# Altium schematic sheet Ethernet_Interface.SchDoc: STM32F446 CNC
size B; Author: AM; CompanyName: Expatria Technologies; DrawnBy: A.Marles; Engineer: AM; Organization: Expatria Technolgoies; Address1: PO Box 2084; Address3: Merritt, BC V1K 1B8; Address4: Canada; DocumentNumber: 7; SheetNumber: 7; SheetTotal: 26
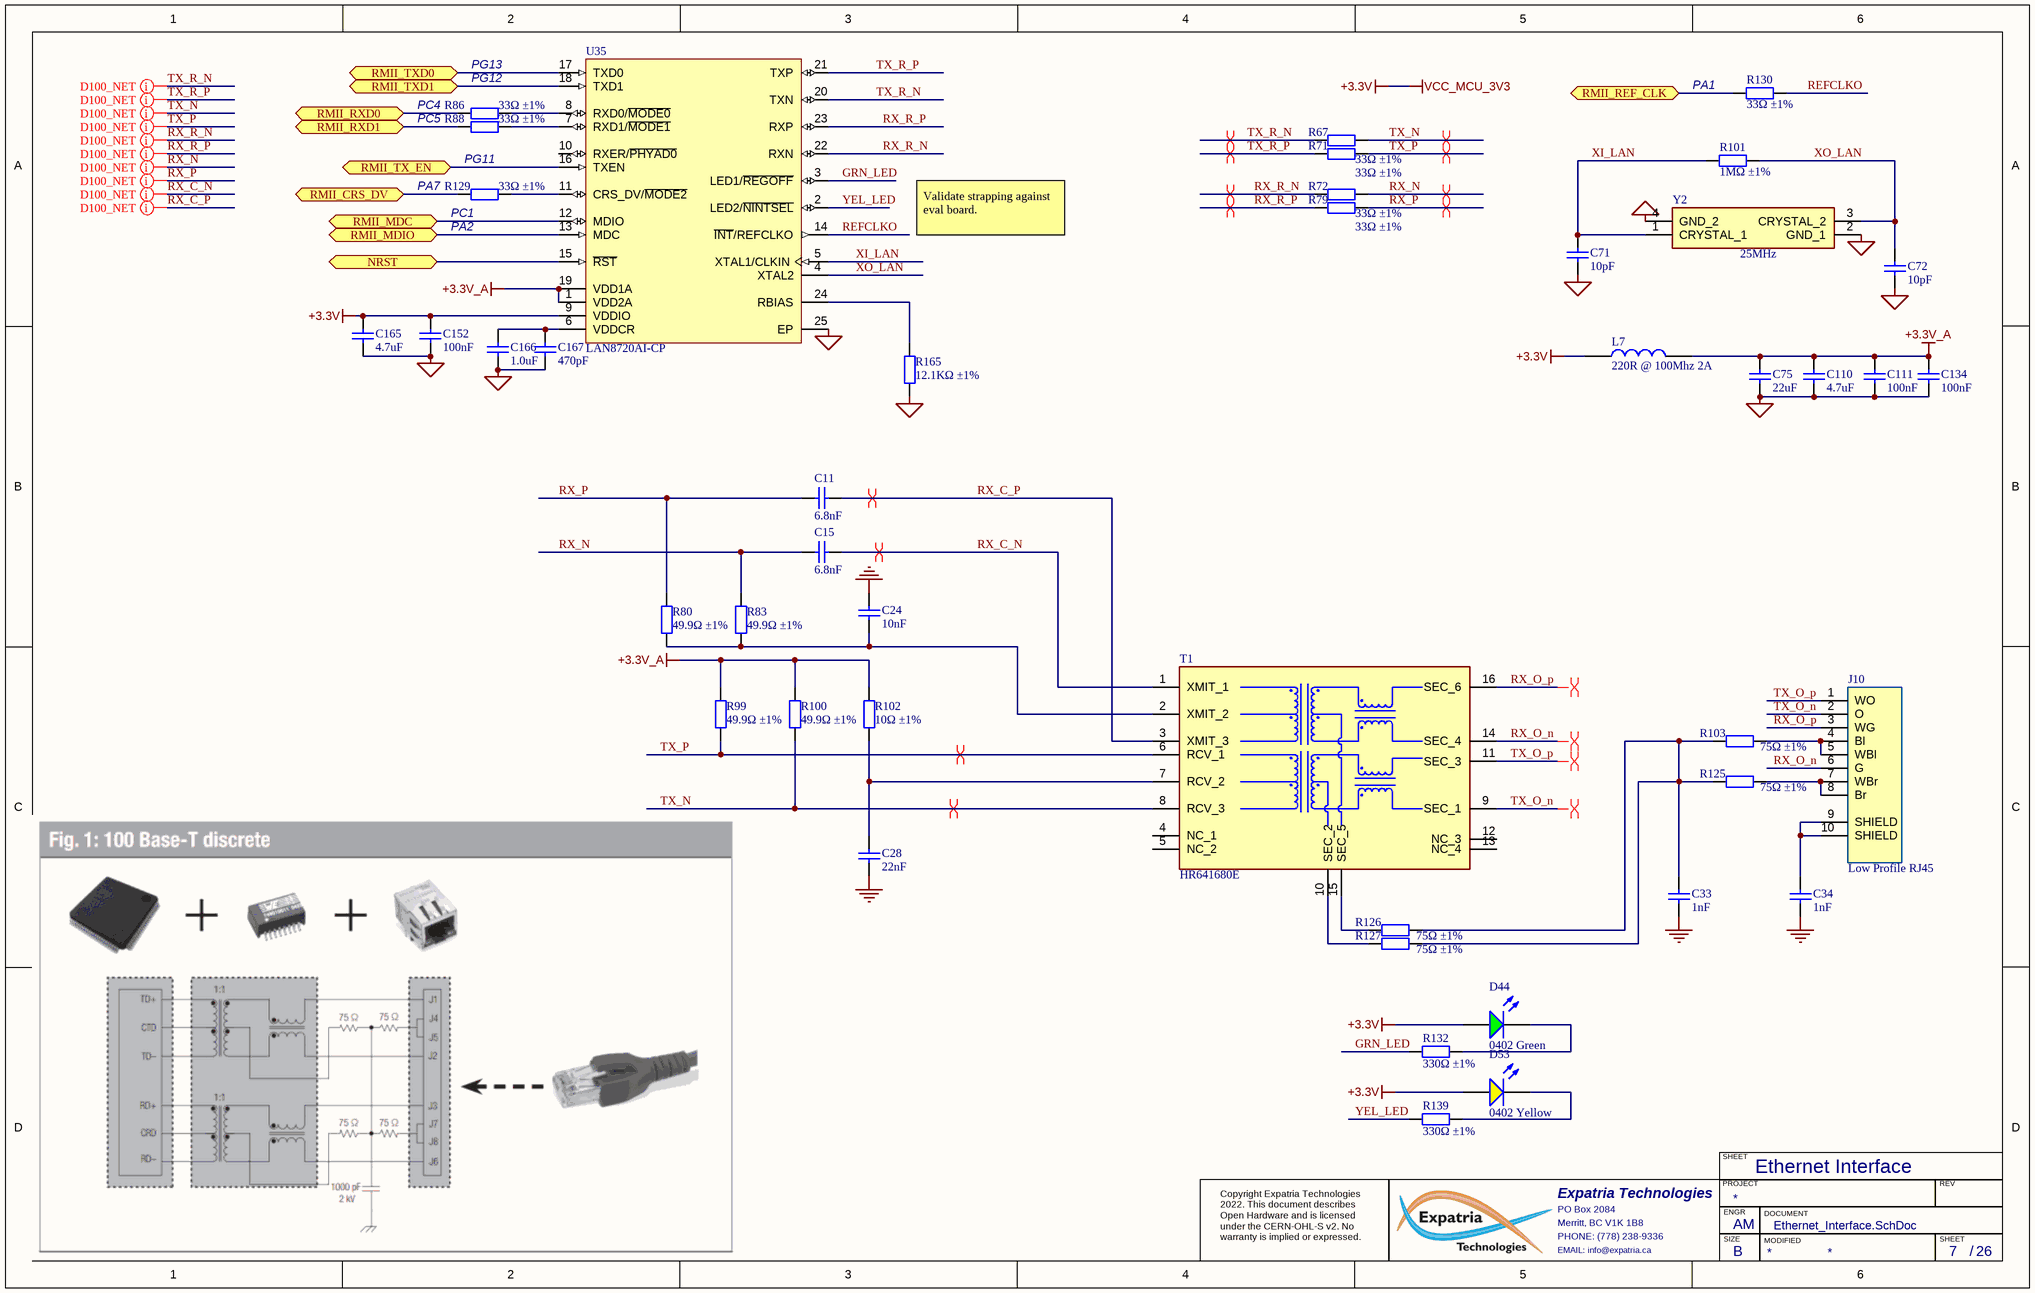
[diagram p0: Ethernet_Interface.SchDoc]

## Parts
C11  6.8nF  [0402_C]
C15  6.8nF  [0402_C]
C24  10nF  [0402_C]
C28  22nF  [0402_C]
C33  1nF  [1206_C]
C34  1nF  [1206_C]
C71  10pF  [0402_C]
C72  10pF  [0402_C]
C75  22uF  [0805_C]
C110  4.7uF  [0603_C]
C111  100nF  [0402_C]
C134  100nF  [0402_C]
C152  100nF  [0402_C]
C165  4.7uF  [0603_C]
C166  1.0uF  [0402_C]
C167  470pF  [0402_C]
D44  0402 Green  [LED 0402_1005 RED]
D53  0402 Yellow  [LED 0402_1005 RED]
J10  Low Profile RJ45  [RJ45-SMD_MJ88-B011-HLSV6-P]
L7  220R @ 100Mhz 2A  [0805_R]
R67  33Ω ±1%  [0402_R]
R71  33Ω ±1%  [0402_R]
R72  33Ω ±1%  [0402_R]
R79  33Ω ±1%  [0402_R]
R80  49.9Ω ±1%  [0402_R]
R83  49.9Ω ±1%  [0402_R]
R86  33Ω ±1%  [0402_R]
R88  33Ω ±1%  [0402_R]
R99  49.9Ω ±1%  [0402_R]
R100  49.9Ω ±1%  [0402_R]
R101  1MΩ ±1%  [0402_R]
R102  10Ω ±1%  [0402_R]
R103  75Ω ±1%  [0402_R]
R125  75Ω ±1%  [0402_R]
R126  75Ω ±1%  [0402_R]
R127  75Ω ±1%  [0402_R]
R129  33Ω ±1%  [0402_R]
R130  33Ω ±1%  [0402_R]
R132  330Ω ±1%  [0402_R]
R139  330Ω ±1%  [0402_R]
R165  12.1KΩ ±1%  [0805_R]
T1  HR641680E  [HR641680E]
U35  LAN8720AI-CP  [MCHP-QFN-24_V]
Y2  value 25MHz  [YSX321SL]  (hidden comment: X322525MSB4SI)

## Ports
NRST (bidir), RMII_CRS_DV (bidir), RMII_MDC (bidir), RMII_MDIO (bidir), RMII_REF_CLK (bidir), RMII_RXD0 (bidir), RMII_RXD1 (bidir), RMII_TX_EN (bidir), RMII_TXD0 (bidir), RMII_TXD1 (bidir)

## Nets
+3.3V: C152.2 C165.2 D44.A D53.A L7.1 U35.9(VDDIO)  [also labelled VCC_MCU_3V3]
+3.3V_A: C75.2 C110.2 C111.2 C134.2 L7.2 R99.1 R100.1 R102.1 U35.1(VDD2A) U35.19(VDD1A)
GND: C24.1 C28.1 C33.1 C34.1
MCU_GND: C71.1 C72.1 C75.1 C110.1 C111.1 C134.1 C152.1 C165.1 C166.1 C167.1 R165.1 U35.25(EP) Y2.2(GND_1) Y2.4(GND_2)
GRN_LED: R132.1 U35.3(LED1/~{REGOFF})
NRST: U35.15(~{RST}) ; port NRST
REFCLKO: R130.2 U35.14(~{INT}/REFCLKO)
RMII_CRS_DV: R129.1 ; port RMII_CRS_DV
RMII_MDC: U35.12(MDIO) ; port RMII_MDC
RMII_MDIO: U35.13(MDC) ; port RMII_MDIO
RMII_REF_CLK: R130.1 ; port RMII_REF_CLK
RMII_RXD0: R86.1 ; port RMII_RXD0
RMII_RXD1: R88.1 ; port RMII_RXD1
RMII_TX_EN: U35.16(TXEN) ; port RMII_TX_EN
RMII_TXD0: U35.17(TXD0) ; port RMII_TXD0
RMII_TXD1: U35.18(TXD1) ; port RMII_TXD1
RX_C_N: C15.1 T1.1(XMIT_1)
RX_C_P: C11.1 T1.3(XMIT_3)
RX_N: C15.2 R72.1 R83.2
RX_O_n: J10.6(G) T1.14(SEC_4)
RX_O_p: J10.3(WG) T1.16(SEC_6)
RX_P: C11.2 R79.1 R80.2
RX_R_N: R72.2 U35.22(RXN)
RX_R_P: R79.2 U35.23(RXP)
TX_N: R67.1 R100.2 T1.8(RCV_3)
TX_O_n: J10.2(O) T1.9(SEC_1)
TX_O_p: J10.1(WO) T1.11(SEC_3)
TX_P: R71.1 R99.2 T1.6(RCV_1)
TX_R_N: R67.2 U35.20(TXN)
TX_R_P: R71.2 U35.21(TXP)
XI_LAN: C71.2 R101.1 U35.5(XTAL1/CLKIN) Y2.1(CRYSTAL_1)
XO_LAN: C72.2 R101.2 U35.4(XTAL2) Y2.3(CRYSTAL_2)
YEL_LED: R139.1 U35.2(LED2/~{NINTSEL})
NetC24_2: C24.2 R80.1 R83.1 T1.2(XMIT_2)
NetC28_2: C28.2 R102.2 T1.7(RCV_2)
NetC33_2: C33.2 R103.2 R125.2 R126.1 R127.1
NetC34_2: C34.2 J10.9(SHIELD) J10.10(SHIELD)
NetC166_2: C166.2 C167.2 U35.6(VDDCR)
NetD44_K: D44.K R132.2
NetD53_K: D53.K R139.2
NetJ10_4: J10.4(Bl) J10.5(WBl) R103.1
NetJ10_7: J10.7(WBr) J10.8(Br) R125.1
NetR86_2: R86.2 U35.8(RXD0/~{MODE0})
NetR88_2: R88.2 U35.7(RXD1/~{MODE1})
NetR126_2: R126.2 T1.15(SEC_5)
NetR127_2: R127.2 T1.10(SEC_2)
NetR129_2: R129.2 U35.11(CRS_DV/~{MODE2})
NetR165_2: R165.2 U35.24(RBIAS)

Not connected (* = marked no-connect by the designer): T1 4(NC_1) 5(NC_2) 12(NC_3) 13(NC_4); U35 10(RXER/~{PHYAD0})

## Layout directives
differential pair: RX_C_N, RX_C_P, RX_N, RX_O_n, RX_O_p, RX_P, RX_R_N, RX_R_P, TX_N, TX_O_n, TX_O_p, TX_P, TX_R_N, TX_R_P
net class D100_NET: RX_C_N, RX_C_P, RX_N, RX_P, RX_R_N, RX_R_P, TX_N, TX_P, TX_R_N, TX_R_P

## Notes on the sheet
- PG13
- PG12
- (near R130) PA1
- PC4
- PC5
- PG11
- (near R129) PA7
- (near R129) PC1
- (near R129) PA2
- Validate strapping against eval board.
- Ethernet Interface
- SHEET
- Expatria Technologies
- PO Box 2084
- Merritt, BC V1K 1B8
- PHONE: (778) 238-9336
- PROJECT
- SIZE
- ENGR
- MODIFIED
- DOCUMENT
- REV
- Copyright Expatria Technologies 2022. This document describes Open Hardware and is licensed under the CERN-OHL-S v2. No warranty is implied or expressed.
- EMAIL: info@expatria.ca
- B
- /

## Library data of the parts
C11 C15 = 0402 6.8nF (682) 10% 50V: Chip capacitors; Manufacturer: Guangdong Fenghua Advanced Tech; PartNumber: 0402B682K500NT; Tolerance: 10%; Voltage: 50V; ComponentLink1Description: Supplier link; ComponentLink1URL: http://www.szlcsc.com/product/details_1894.html; Package: 0402; Supplier: LC; SuppliersPartNumber: C1542; Capacitance: 6.8nF
C24 = 0402 10nF (103) 10% 50V: Chip capacitors; Manufacturer: Samsung Electro-Mechanics; PartNumber: CL05B103KB5NNNC; Tolerance: 10%; Voltage: 50V; ComponentLink1Description: Supplier link; ComponentLink1URL: http://www.szlcsc.com/product/details_15869.html; Package: 0402; Supplier: LC; SuppliersPartNumber: C15195; Capacitance: 10nF
C28 = 0402 22nF (223) 10% 50V: Chip capacitors; Manufacturer: Guangdong Fenghua Advanced Tech; PartNumber: 0402B223K500NT; Tolerance: 10%; Voltage: 50V; ComponentLink1Description: Supplier link; ComponentLink1URL: http://www.szlcsc.com/product/details_1884.html; Package: 0402; Supplier: LC; SuppliersPartNumber: C1532; Capacitance: 22nF
C33 C34 = 1206 1nF (102) 10% 500V: Chip capacitors; Manufacturer: Samsung Electro-Mechanics; PartNumber: CL31B102KGFNNNE; Tolerance: 10%; Voltage: 500V; ComponentLink1Description: Supplier link; ComponentLink1URL: http://www.szlcsc.com/product/details_36187.html; Package: 1206; Supplier: LC; SuppliersPartNumber: C35216; Capacitance: 1nF
C71 C72 = 0402 10pF (100) 5% 50V: Chip capacitors; Manufacturer: Samsung Electro-Mechanics; Manufacturer Part Number: CL05C100JB5NNNC; Tolerance: 5%; Voltage: 50V; ComponentLink1Description: Supplier link; ComponentLink1URL: http://www.szlcsc.com/product/details_33914.html; Package: 0402; Supplier: LC; SuppliersPartNumber: C32949; Capacitance: 10pF
C75 = 0805 22uF (226) 20% 25V: 25V 22uF X5R ±20% 0805 Multilayer Ceramic Capacitors MLCC - SMD/SMT ROHS; Manufacturer: Samsung Electro-Mechanics; Manufacturer Part Number: CL21A226MAQNNNE; ComponentLink1Description: Supplier link; ComponentLink1URL: http://www.szlcsc.com/product/details_46786.html; Package: 0805; Supplier: LC; SuppliersPartNumber: C45783; Capacitance: 22uF; Tolerance: 20%; Voltage: 25V
C110 C165 = 0603 4.7uF (475) 10% 16V: 16V 4.7uF X5R ±10% 0603 Multilayer Ceramic Capacitors MLCC - SMD/SMT ROHS; Manufacturer: Samsung Electro-Mechanics; Manufacturer Part Number: CL10A475KO8NNNC; ComponentLink1Description: Supplier link; ComponentLink1URL: http://www.szlcsc.com/product/details_20375.html; Package: 0603; Supplier: LC; SuppliersPartNumber: C19666; Capacitance: 4.7uF; Tolerance: 10%; Voltage: 16V
C111 C134 C152 = 0402 100nF (104) 10% 16V: 16V 100nF X7R ±10% 0402 Multilayer Ceramic Capacitors MLCC - SMD/SMT ROHS; Manufacturer: Samsung Electro-Mechanics; Manufacturer Part Number: CL05B104KO5NNNC; ComponentLink1Description: Supplier link; ComponentLink1URL: http://www.szlcsc.com/product/details_1877.html; Package: 0402; Supplier: LC; SuppliersPartNumber: C1525; Capacitance: 100nF; Tolerance: 10%; Voltage: 16V
C166 = 0402 1.0uF (105) 10% 25V: Chip capacitor; Manufacturer: Samsung Electro-Mechanics; PartNumber: CL05A105KA5NQNC; Capacitance: 1uF; Tolerance: 10%; Voltage: 25V; ComponentLink1Description: Supplier link; ComponentLink1URL: http://www.szlcsc.com/product/details_53938.html; Package: 0402; Supplier: LC; SuppliersPartNumber: C52923
C167 = 0402 470pF (471) 10% 50V: Chip capacitors; Manufacturer: Guangdong Fenghua Advanced Tech; PartNumber: 0402B471K500NT; Tolerance: 10%; Voltage: 50V; ComponentLink1Description: Supplier link; ComponentLink1URL: http://www.szlcsc.com/product/details_1889.html; Package: 0402; Supplier: LC; SuppliersPartNumber: C1537; Capacitance: 470pF
D44 = 0402 LED Green: LED; Package: 0402; Supplier: LC; SuppliersPartNumber: C130723; Color: Green
D53 = 0402 LED Yellow: LED; ComponentLink1Description: 供应商链接; ComponentLink1URL: http://www.szlcsc.com/product/details_73147.html; Package: 0402; Supplier: LC; SuppliersPartNumber: C130721; Color: Yellow
J10 = MJ88-B011-HLSV6-P: Micro USB; MF: Heling; SuppliersPartNumber: C501463; Part+Number: MJ88-B011-HLSV6-P
L7 = CBW201209U221T: 150mΩ ±25% 220Ω@100MHz 0805 Ferrite Beads ROHS; Manufacturer: FH (Guangdong Fenghua Advanced Tech); Package: 0402; Supplier: LC; SuppliersPartNumber: C139188; Manufacturer Part Number: CBW201209U221T
R67 R71 R72 R79 R86 R88 R129 R130 = 0402 33R (33R0) 1%: Chip resistor; Manufacturer: Uniroyal Elec; Manufacturer Part Number: 0402WGF330JTCE; Power: 1/16W; ComponentLink1Description: Supplier link; ComponentLink1URL: http://www.szlcsc.com/product/details_25848.html; Package: 0402; Supplier: LC; SuppliersPartNumber: C25105; Resistance: 33Ω; Tolerance: 1%
R80 R83 R99 R100 = 0402 49.9R (49R9) 1%: Chip resistor; Manufacturer: Uniroyal Elec; PartNumber: 0402WGF499JTCE; Power: 1/16W; ComponentLink1Description: Supplier link; ComponentLink1URL: http://www.szlcsc.com/product/details_25863.html; Package: 0402; Supplier: LC; SuppliersPartNumber: C25120; Resistance: 49.9Ω; Tolerance: 1%
R101 = 0402 1M (1004) 1%: Chip resistor; Manufacturer: Uniroyal Elec; Manufacturer Part Number: 0402WGF1004TCE; Power: 1/16W; ComponentLink1Description: Supplier link; ComponentLink1URL: http://www.szlcsc.com/product/details_26826.html; Package: 0402; Supplier: LC; SuppliersPartNumber: C26083; Resistance: 1MΩ; Tolerance: 1%
R102 = 0402 10R (10R0) 1%: Chip resistor; Manufacturer: Uniroyal Elec; PartNumber: 0402WGF100JTCE; Power: 1/16W; ComponentLink1Description: Supplier link; ComponentLink1URL: http://www.szlcsc.com/product/details_25820.html; Package: 0402; Supplier: LC; SuppliersPartNumber: C25077; Resistance: 10Ω; Tolerance: 1%
R103 R125-R127 = 0402 75R (75R0) 1%: Chip resistor; Manufacturer: Uniroyal Elec; PartNumber: 0402WGF750JTCE; Power: 1/16W; ComponentLink1Description: Supplier link; ComponentLink1URL: http://www.szlcsc.com/product/details_25876.html; Package: 0402; Supplier: LC; SuppliersPartNumber: C25133; Resistance: 75Ω; Tolerance: 1%
R132 R139 = 0402 330R (3300) 1%: Chip resistor; Manufacturer: Uniroyal Elec; PartNumber: 0402WGF3300TCE; Power: 1/16W; ComponentLink1Description: Supplier link; ComponentLink1URL: http://www.szlcsc.com/product/details_25847.html; Package: 0402; Supplier: LC; SuppliersPartNumber: C25104; Resistance: 330Ω; Tolerance: 1%
R165 = 0805 12.1K (1212) 1%: Chip resistor; Manufacturer: Uniroyal Elec; Power: 1/8W; ComponentLink1Description: Supplier link; ComponentLink1URL: https://item.szlcsc.com/18119.html; Package: 0805; Supplier: LC; SuppliersPartNumber: C17431; Tolerance: 1%
T1 = HR641680E: Transformer; Manufacturer_Name: Hanrun Electronics; Datasheet Link: https://datasheet.lcsc.com/szlcsc/Zhongshan-HanRun-Elec-HR641680E_C189555.pdf; Height: 5.715mm; Manufacturer_Part_Number: HR641680E
U35 = CMP-2000-05216-1: RMII 10/100 Ethernet Transceiver with HP Auto-MDIX Support, -40 to 85 degC, 24-Pin QFN, RoHS, Tray; Manufacturer: Microchip; Number of Drivers/Receivers: 4/4; Other Names: 638-1084; Dynamic Catalog: PhysicalLayerTransceiver; Voltage - Supply: 1.6V~3.6V; Package Reference: QFN-24; Series: -; Protocol: RMII; Packaging: Tray; Datasheet URL: http://ww1.microchip.com/downloads/en/DeviceDoc/8720a.pdf; Package Description: 24-Pin Quad Flat No-lead Package, Body 4 x 4 mm, Pitch 0.5 mm; Mounting Type: SurfaceMount; Package / Case: 24-VFQFNExposedPad; Category: IntegratedCircuits(ICs); Family: Interface-Drivers,Receivers,Transceivers; Type: Transceiver; Supplier Device Package: 24-QFN(4x4); Manufacturer URL: http://www.microchip.com/; Datasheet Version: Rev. 1.4, 08/2012; Standard Package: 490
Y2 = X322525MSB4SI: 25MHz SMD Crystal Resonator 20pF ±10ppm ±30ppm -40℃~+85℃ SMD3225-4P Crystals ROHS; Manufacturer 1: Yangxing Tech; Height: 0.8mm; SuppliersPartNumber: C13740; Supplier 1: LCSC; Supplier Part Number 1: C13740; Manufacturer Part Number 1: X322525MSB4SI; Manufacturer: Yangxing Tech; Manufacturer Part Number: X322525MSB4SI